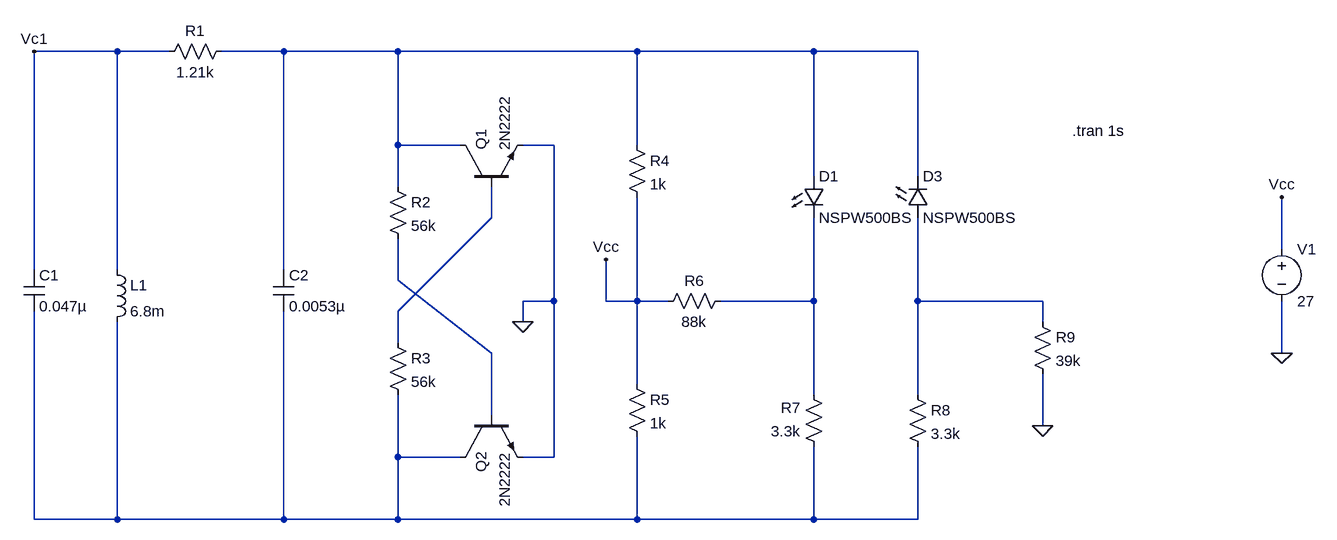
[diagram p0: schematic chua.asc]
chua.asc, the LTspice schematic file:
Version 4
SHEET 1 1960 680
WIRE 96 -208 -32 -208
WIRE 176 -208 96 -208
WIRE 352 -208 256 -208
WIRE 528 -208 352 -208
WIRE 896 -208 528 -208
WIRE 1168 -208 896 -208
WIRE 1328 -208 1168 -208
WIRE 528 -64 528 -208
WIRE 624 -64 528 -64
WIRE 768 -64 720 -64
WIRE 896 -64 896 -208
WIRE 1168 -16 1168 -208
WIRE 1328 -16 1328 -208
WIRE 528 0 528 -64
WIRE 672 48 672 0
WIRE 1888 96 1888 16
WIRE -32 128 -32 -208
WIRE 96 128 96 -208
WIRE 352 128 352 -208
WIRE 528 144 528 80
WIRE 768 176 768 -64
WIRE 768 176 720 176
WIRE 848 176 848 112
WIRE 896 176 896 16
WIRE 896 176 848 176
WIRE 944 176 896 176
WIRE 1168 176 1168 48
WIRE 1168 176 1024 176
WIRE 1328 176 1328 48
WIRE 1520 176 1328 176
WIRE 528 192 672 48
WIRE 720 208 720 176
WIRE 1520 208 1520 176
WIRE 528 240 528 192
WIRE 672 256 528 144
WIRE 1888 256 1888 176
WIRE 896 304 896 176
WIRE 1168 320 1168 176
WIRE 1328 320 1328 176
WIRE 672 352 672 256
WIRE 1520 368 1520 288
WIRE 528 416 528 320
WIRE 624 416 528 416
WIRE 768 416 768 176
WIRE 768 416 720 416
WIRE -32 512 -32 192
WIRE 96 512 96 208
WIRE 96 512 -32 512
WIRE 352 512 352 192
WIRE 352 512 96 512
WIRE 528 512 528 416
WIRE 528 512 352 512
WIRE 896 512 896 384
WIRE 896 512 528 512
WIRE 1168 512 1168 400
WIRE 1168 512 896 512
WIRE 1328 512 1328 400
WIRE 1328 512 1168 512
FLAG 720 208 0
FLAG 848 112 Vcc
FLAG 1520 368 0
FLAG 1888 16 Vcc
FLAG 1888 256 0
FLAG -32 -208 Vc1
SYMBOL cap -48 128 R0
SYMATTR InstName C1
SYMATTR Value 0.047µ
SYMBOL cap 336 128 R0
SYMATTR InstName C2
SYMATTR Value 0.0053µ
SYMBOL res 272 -224 R90
WINDOW 0 0 56 VBottom 2
WINDOW 3 32 56 VTop 2
SYMATTR InstName R1
SYMATTR Value 1.21k
SYMBOL ind 80 112 R0
SYMATTR InstName L1
SYMATTR Value 6.8m
SYMBOL res 512 -16 R0
SYMATTR InstName R2
SYMATTR Value 56k
SYMBOL res 512 224 R0
SYMATTR InstName R3
SYMATTR Value 56k
SYMBOL res 880 -80 R0
SYMATTR InstName R4
SYMATTR Value 1k
SYMBOL res 880 288 R0
SYMATTR InstName R5
SYMATTR Value 1k
SYMBOL res 1040 160 R90
WINDOW 0 0 56 VBottom 2
WINDOW 3 32 56 VTop 2
SYMATTR InstName R6
SYMATTR Value 88k
SYMBOL res 1184 416 R180
WINDOW 0 36 76 Left 2
WINDOW 3 36 40 Left 2
SYMATTR InstName R7
SYMATTR Value 3.3k
SYMBOL LED 1152 -16 R0
SYMATTR InstName D1
SYMATTR Value NSPW500BS
SYMATTR Description Diode
SYMATTR Type diode
SYMBOL LED 1312 48 M180
WINDOW 0 24 64 Left 2
WINDOW 3 24 0 Left 2
SYMATTR InstName D3
SYMATTR Value NSPW500BS
SYMATTR Description Diode
SYMATTR Type diode
SYMBOL res 1312 304 R0
SYMATTR InstName R8
SYMATTR Value 3.3k
SYMBOL res 1504 192 R0
SYMATTR InstName R9
SYMATTR Value 39k
SYMBOL npn 624 0 R270
SYMATTR InstName Q1
SYMATTR Value 2N2222
SYMBOL npn 624 352 M90
SYMATTR InstName Q2
SYMATTR Value 2N2222
SYMBOL voltage 1888 80 R0
WINDOW 123 0 0 Left 0
WINDOW 39 0 0 Left 0
SYMATTR InstName V1
SYMATTR Value 27
TEXT 1566 -86 Left 2 !.tran 1s

The netlist it stands for:
* chua.asc
C1 Vc1 N006 0.047µ
C2 N001 N006 0.0053µ
R1 N001 Vc1 1.21k
L1 Vc1 N006 6.8m
R2 N001 N003 56k
R3 N002 N006 56k
R4 N001 Vcc 1k
R5 Vcc N006 1k
R6 N004 Vcc 88k
R7 N006 N004 3.3k
D1 N001 N004 NSPW500BS
D3 N005 N001 NSPW500BS
R8 N005 N006 3.3k
R9 N005 0 39k
Q1 N001 N002 0 0 2N2222
Q2 N006 N003 0 0 2N2222
V1 Vcc 0 27
.model D D
.lib standard.dio
.model NPN NPN
.model PNP PNP
.lib standard.bjt
.tran 1s
.backanno
.end